# Altium schematic sheet Fan & Power Out.SchDoc: Laser PCB
size A3; DrawnBy: James Singleton; Organization: TMC Technology Ltd.; DocumentNumber: 4; Revision: A; SheetNumber: 2; SheetTotal: 18; Drawn Date: 22/12/2020
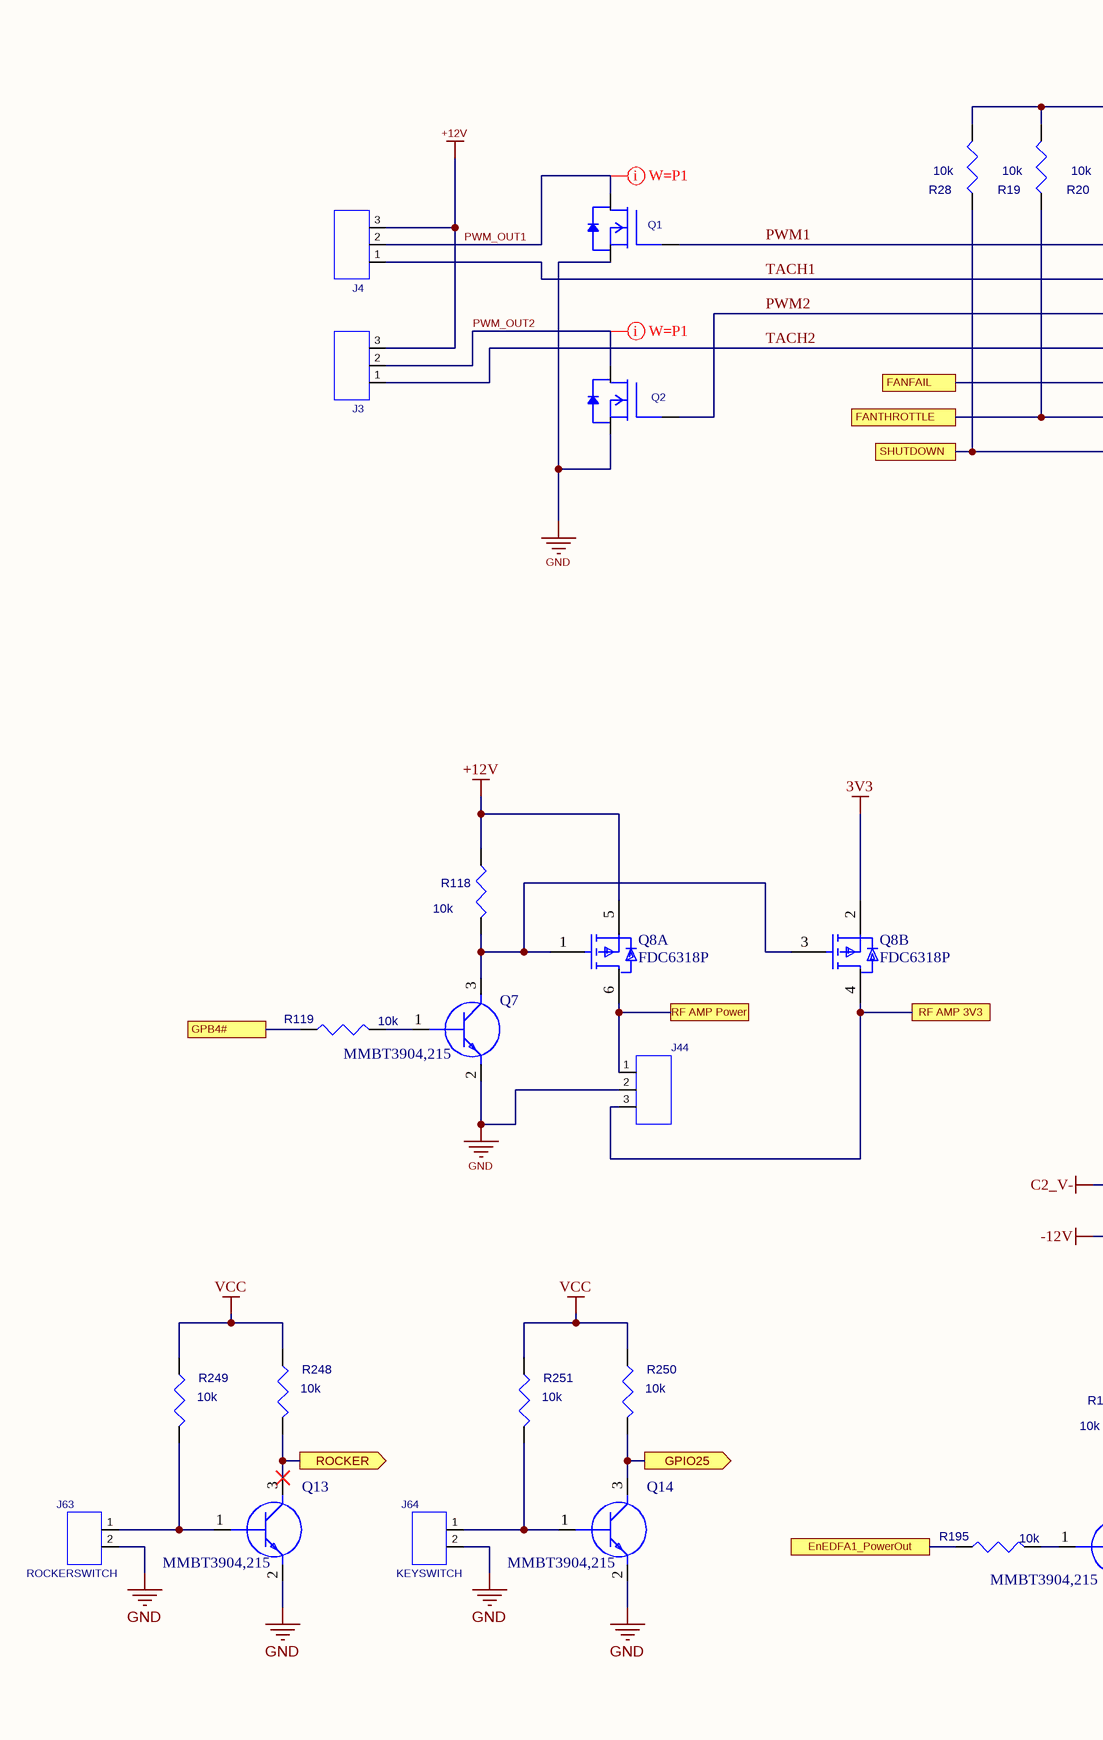
[diagram p0: Fan & Power Out.SchDoc, left]
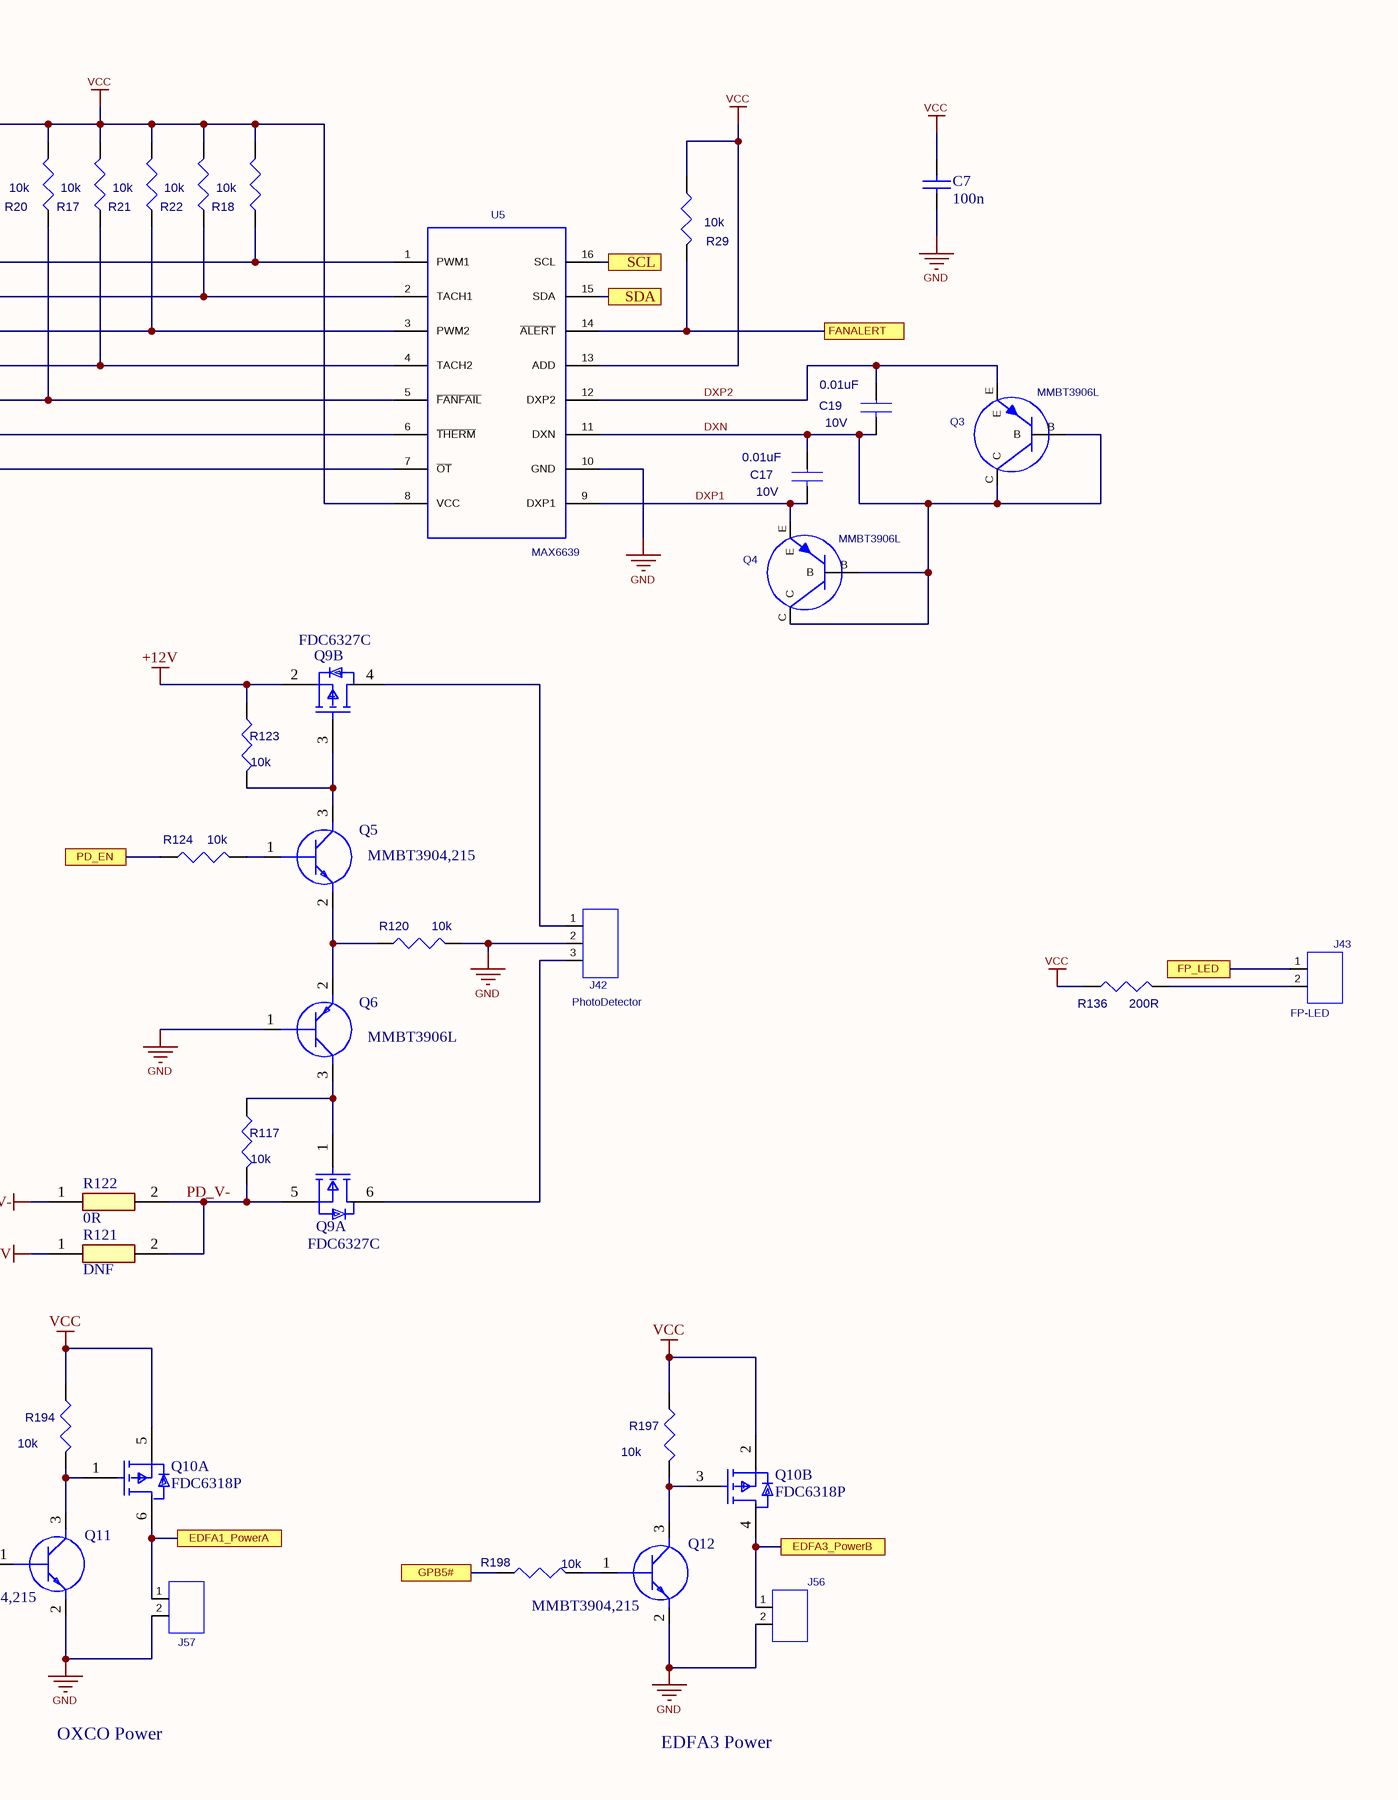
[diagram p1: Fan & Power Out.SchDoc, right]

## Parts
C7  100n  [CAPC1608X90X35LL15T15]
C17  value 0.01uF  Rated_Voltage: 10V  [CC0603N]  (hidden comment: CAP)
C19  value 0.01uF  Rated_Voltage: 10V  [CC0603N]  (hidden comment: CAP)
J3  CON03  [AE-6410-3W-VERTICAL]  (value not drawn)
J4  CON03  [AE-6410-3W-VERTICAL]  (value not drawn)
J42  PhotoDetector  [AE-6410-3W-VERTICAL]
J43  FP-LED  [AE-6410-2W-VERTICAL]
J44  CON03  [AE-6410-3W-VERTICAL]  (value not drawn)
J56  EDFA3 Power  [AE-6410-2W-VERTICAL]
J57  OXCO Power  [AE-6410-2W-VERTICAL]
J63  ROCKERSWITCH  [AE-6410-2W-VERTICAL]
J64  KEYSWITCH  [AE-6410-2W-VERTICAL]
Q1  DMG3418L-7  [SOT95P240X110-3N]  (value not drawn)
Q2  DMG3418L-7  [SOT95P240X110-3N]  (value not drawn)
Q3  MMBT3906L  [MMBT3906L]
Q4  MMBT3906L  [MMBT3906L]
Q5  MMBT3904,215  [MMBT3904215]
Q6  MMBT3906L  [SOT96P237X111-3N]
Q7  MMBT3904,215  [MMBT3904215]
Q8  FDC6318P  [ON_Semi_419BL_0]  (parts A,B of 2)
Q9  FDC6327C  [SOT95P275X110-6N]  (parts A,B of 2)
Q10  FDC6318P  [ON_Semi_419BL_0]  (parts A,B of 2)
Q11  MMBT3904,215  [MMBT3904215]
Q12  MMBT3904,215  [MMBT3904215]
Q13  MMBT3904,215  [MMBT3904215]
Q14  MMBT3904,215  [MMBT3904215]
R17  value 10k  [CR0603N]  (hidden comment: RES)
R18  value 10k  [CR0603N]  (hidden comment: RES)
R19  value 10k  [CR0603N]  (hidden comment: RES)
R20  value 10k  [CR0603N]  (hidden comment: RES)
R21  value 10k  [CR0603N]  (hidden comment: RES)
R22  value 10k  [CR0603N]  (hidden comment: RES)
R28  value 10k  [CR0603N]  (hidden comment: RES)
R29  value 10k  [CR0603N]  (hidden comment: RES)
R117  value 10k  [CR0603N]  (hidden comment: RES)
R118  value 10k  [CR0603N]  (hidden comment: RES)
R119  value 10k  [CR0603N]  (hidden comment: RES)
R120  value 10k  [CR0603N]  (hidden comment: RES)
R121  value DNF  [RESC1608X55N]
R122  value 0R  [RESC1608X55N]
R123  value 10k  [CR0603N]  (hidden comment: RES)
R124  value 10k  [CR0603N]  (hidden comment: RES)
R136  value 200R  [CR0603N]  (hidden comment: RES)
R194  value 10k  [CR0603N]  (hidden comment: RES)
R195  value 10k  [CR0603N]  (hidden comment: RES)
R197  value 10k  [CR0603N]  (hidden comment: RES)
R198  value 10k  [CR0603N]  (hidden comment: RES)
R248  value 10k  [CR0603N]  (hidden comment: RES)
R249  value 10k  [CR0603N]  (hidden comment: RES)
R250  value 10k  [CR0603N]  (hidden comment: RES)
R251  value 10k  [CR0603N]  (hidden comment: RES)
U5  MAX6639  [SOP63P602X173-16N]

## Ports
EDFA1_PowerA (see PIO[1A], PIO[2A]), EDFA3_PowerB (see PIO[1B], PIO[1C], PIO[2B], PIO[2C]), EnEDFA1_PowerOut (see PIO[2C]), FANALERT (see ChipSelects+Faults[1D]), FANFAIL (see ChipSelects+Faults[1D]), FANTHROTTLE (see ChipSelects+Faults[1D]), FP_LED (see PI_INTERFACE[3A]), GPB4# (see PIO[2C]), GPB5# (see PIO[2C]), GPIO25 (out, see PI_INTERFACE[5B]), PD_EN (see PIO[7B]), RF AMP 3V3, RF AMP Power, ROCKER (out, see PI_INTERFACE[3A]), SCL (see ADC-DAC[2C], ADC-DAC[3A], ADC-DAC[4B], ADC-DAC[4C], ADC-DAC[5C], ADC-DAC[6A], PI_INTERFACE[3A], TEC_CONTROLLER_1[6B], TEC_CONTROLLER_1[7A], TEC_CONTROLLER_1[8B]), SDA (see ADC-DAC[2C], ADC-DAC[3A], ADC-DAC[4B], ADC-DAC[4C], ADC-DAC[5C], ADC-DAC[6A], PI_INTERFACE[3A], TEC_CONTROLLER_1[6B], TEC_CONTROLLER_1[7A], TEC_CONTROLLER_1[7B]), SHUTDOWN (see ChipSelects+Faults[1D])

## Nets
3V3: Q8.2(S2)
+12V: J3.3 J4.3 Q8.5(S1) Q9.2(S2) R118.1 R123.1
-12V: R121.1
C2_V-: R122.1
GND: C7.2 J42.2 J44.2 J56.2 J57.2 J63.2 J64.2 Q1.2 Q2.2 Q6.1(B) Q7.2(E) Q11.2(E) Q12.2(E) Q13.2(E) Q14.2(E) R120.2 U5.10(GND)
VCC: C7.1 Q10.2(S2) Q10.5(S1) R17.2 R18.2 R19.2 R20.2 R21.2 R22.2 R28.2 R29.2 R136.1 R194.1 R197.1 R248.1 R249.1 R250.1 R251.1 U5.8(VCC) U5.13(ADD)
DXN: C17.1 C19.2 Q3.B Q3.C Q4.B Q4.C U5.11(DXN)
DXP1: C17.2 Q4.E U5.9(DXP1)
DXP2: C19.1 Q3.E U5.12(DXP2)
EDFA1_PowerA: J57.1 Q10.6(D1) ; port EDFA1_PowerA
EDFA3_PowerB: J56.1 Q10.4(D2) ; port EDFA3_PowerB
EnEDFA1_PowerOut: R195.1 ; port EnEDFA1_PowerOut
FANALERT: R29.1 U5.14(~{ALERT}) ; port FANALERT
FANFAIL: R20.1 U5.5(~{FANFAIL}) ; port FANFAIL
FANTHROTTLE: R19.1 U5.6(~{THERM}) ; port FANTHROTTLE
FP_LED: J43.1 ; port FP_LED
GPB4#: R119.1 ; port GPB4#
GPB5#: R198.1 ; port GPB5#
GPIO25: Q14.3(C) R250.2 ; port GPIO25
PD_EN: R124.1 ; port PD_EN
PD_V-: Q9.5(S2) R117.2 R121.2 R122.2
PWM1: Q1.1 R18.1 U5.1(PWM1)
PWM2: Q2.1 R21.1 U5.3(PWM2)
PWM_OUT1: J4.2 Q1.3
PWM_OUT2: J3.2 Q2.3
RF AMP 3V3: J44.3 Q8.4(D2) ; port RF AMP 3V3
RF AMP Power: J44.1 Q8.6(D1) ; port RF AMP Power
ROCKER: Q13.3(C) R248.2 ; port ROCKER
SCL: U5.16(SCL) ; port SCL
SDA: U5.15(SDA) ; port SDA
SHUTDOWN: R28.1 U5.7(~{OT}) ; port SHUTDOWN
TACH1: J4.1 R22.1 U5.2(TACH1)
TACH2: J3.1 R17.1 U5.4(TACH2)
NetJ42_1: J42.1 Q9.4(D2)
NetJ42_3: J42.3 Q9.6(D2)
NetJ43_2: J43.2 R136.2
NetJ63_1: J63.1 Q13.1(B) R249.2
NetJ64_1: J64.1 Q14.1(B) R251.2
NetQ5_1: Q5.1(B) R124.2
NetQ5_2: Q5.2(E) Q6.2(E) R120.1
NetQ5_3: Q5.3(C) Q9.3(G2) R123.2
NetQ6_3: Q6.3(C) Q9.1(G2) R117.1
NetQ7_1: Q7.1(B) R119.2
NetQ7_3: Q7.3(C) Q8.1(G1) Q8.3(G2) R118.2
NetQ10_1: Q10.1(G1) Q11.3(C) R194.2
NetQ10_3: Q10.3(G2) Q12.3(C) R197.2
NetQ11_1: Q11.1(B) R195.2
NetQ12_1: Q12.1(B) R198.2

## Layout directives
mark named W=P1: PWM_OUT1, PWM_OUT2

## Notes on the sheet
- TMC Technology Ltd.
- Page Contents:
- Project:
- Variant:
- Checked By:
- Size:
- Date:
- Dwg No:
- Sheet
- of
- Revision:

## Library data of the parts
C7 = CMP-1035-02592-3: Chip Capacitor, 100 nF, +/- 10%, 50 V, -55 to 125 degC, 0603 (1608 Metric), RoHS, Tape and Reel; Manufacturer: KEMET; Manufacturer Part Number: C0603C104K5RACTU; Case\Package: 0603; Type (Capacitors): X7R; Capacitance: 100 nF; Voltage Rating: 50 V; Pins: 2; Max Operating Temperature: 125 degC; Min Operating Temperature: -55 degC; Case Code (Imperial): 0603; DatasheetVersion: 07/2016; Package Quantity: 4000; Length: 1.6 mm; REACH SVHC: No SVHC; Packaging: Tape and Reel; Case Code (Metric): 1608; Mounting Technology: Surface Mount; RoHSCompliant: true; Height: 0.9 mm; ComponentLink1URL: http://www.avx.com/; ComponentLink2URL: http://datasheets.avx.com/X7RDielectric.pdf; Mount: Surface Mount; ComponentLink2Description: Datasheet; Width: 0.81 mm; PackageReference: 0603; PackageDescription: 2-Pin Surface Mount Device, Body 1.6 x 0.81 mm; Radiation Hardening: No; ComponentLink1Description: Manufacturer URL; Voltage Rating (DC): 50 V; Tolerance: 10%; 8Vinv: *
C17 C19 = CAP: CAP.,0.01uF,X5R,10V,10%,0603; Manufacturer: AVX; Manufacturer_PN: 0603ZD103KAT2A; FPLIST: CC0603N,CC0603L,CC0603M; CLASS: DISCRETE; Source_Path: \\MIL-NS1\CIP\SCHEMATIC_SYMBOLS\LTC_CAPACITOR.OLB; Geometry.Height: 37.40mil; Package_Size: 0603; Dielectric_Type: X5R; Tolerance: 10%; PCB DECAL: CC0603N
J3 J4 J42 = CON03: 3 pin Connector; MANUFACTURER1: ADIMPEX (Cod.  LE008003-R); Manufacturer: Molex; VALUE: STRIP1X3VM; SPEA DEVICE CODE: 700; PTEXT3: 3; PTEXT2: 2; PTEXT1: 1; Geometry.Height: 400 mil; UNNAMED1: DNF; Order No: 1360131; VAL: *; TOL: *; NTOL: *; MANUFACTURER2: Molex ( Cod. 22-03-2031 ); DEVICE TYPE: Connector; CASE TYPE: TH; PCB DECAL: AE-6410-3W-VERTICAL; Part No: 22-29-2031; System: Connector
J43 J63 J64 = CON02: 2 pin Connector, straight header, 2.54mm pitch; Part No: 2211S-02G; Manufacturer: Multicomp; Order No: 1593411; PCB DECAL: AE-6410-2W-VERTICAL
J44 = CON03: 3 pin Connector; Manufacturer: Molex; MANUFACTURER1: ADIMPEX (Cod.  LE008003-R); UNNAMED1: DNF; Order No: 1360131; VALUE: STRIP1X3VM; SPEA DEVICE CODE: 700; PTEXT3: 3; PTEXT2: 2; PTEXT1: 1; Geometry.Height: 400 mil; PCB DECAL: AE-6410-3W-VERTICAL; Part No: 22-29-2031; System: Connector; VAL: *; TOL: *; NTOL: *; MANUFACTURER2: Molex ( Cod. 22-03-2031 ); DEVICE TYPE: Connector; CASE TYPE: TH
J56 J57 = CON02: 2 pin Connector; Manufacturer: Molex; UNNAMED1: DNF; Order No: 1360130; PCB DECAL: AE-6410-2W-VERTICAL; Part No: 22-29-2021; System: Connector
Q1 Q2 = DMG3418L-7: MOSFET N-CH 30V 4A SOT23; Manufacturer: Diodes Inc; Geometry.Height: 1.1mm; Order No: 3276189; Part No: DMG3418L-7; PCB DECAL: SOT95P240X110-3N
Q3 Q4 = MMBT3906L: GENERAL PURPOSE PNP SILICON TRANSISTOR; Part Number: MMBT3906LT1G; Manufacturer #1: On Semiconductor; Manufacturer: On Semi; Order No: MMBT3906LT1GOSCT-ND; Geometry.Height: 1.1mm; PCB DECAL: MMBT3906L; Order Number: MMBT3906LT1G; Part No: MMBT3906L
Q5 Q7 Q11-Q14 = MMBT3904,215: Transistor BJT NPN; Manufacturer_Name: Nexperia; Datasheet Link: https://assets.nexperia.com/documents/data-sheet/MMBT3904.pdf; Height: 1.1mm; Manufacturer_Part_Number: MMBT3904,215; Mouser Part Number: 771-MMBT3904T/R; Mouser Price/Stock: https://www.mouser.co.uk/ProductDetail/Nexperia/MMBT3904215?qs=LOCUfHb8d9s%2FW6hzAJGDbw%3D%3D; Arrow Part Number: MMBT3904,215; Arrow Price/Stock: https://www.arrow.com/en/products/mmbt3904215/nexperia?region=nac
Q6 = MMBT3906LT1H: Transistor BJT PNP; Manufacturer_Name: onsemi; Datasheet Link: https://www.mouser.in/datasheet/2/308/1/on_semiconductor_mmbt3906lt1_d-1195239.pdf; Height: 1.11mm; Manufacturer_Part_Number: MMBT3906LT1H; Mouser Part Number: 863-MMBT3906LT1H; Mouser Price/Stock: https://www.mouser.co.uk/ProductDetail/onsemi/MMBT3906LT1H?qs=kbSN2QblFfK%252B3Tf0dtu%2FeQ%3D%3D; Arrow Part Number: MMBT3906LT1H; Arrow Price/Stock: https://www.arrow.com/en/products/mmbt3906lt1h/on-semiconductor?region=nac
Q9 = FDC6327C: Integrated Circuit; Manufacturer_Name: onsemi; Datasheet Link: https://datasheet.datasheetarchive.com/originals/distributors/Datasheets_SAMA/e301740928fca84ccc639c023f90bb32.pdf; Height: 1.1mm; Manufacturer_Part_Number: FDC6327C; Mouser Part Number: 512-FDC6327C; Mouser Price/Stock: https://www.mouser.co.uk/ProductDetail/ON-Semiconductor-Fairchild/FDC6327C?qs=iN0KuJO79KYSwrsClcAPjw%3D%3D; Arrow Part Number: FDC6327C; Arrow Price/Stock: https://www.arrow.com/en/products/fdc6327c/on-semiconductor?region=nac
R17-R22 R28 R29 R117-R120 R123 R124 R194 R195 R197 R198 R248-R251 = RES: RES.,10k OHMS,1%,1/10W,0603; Manufacturer_PN: ERJ3EKF1002V; Manufacturer: PANASONIC; Part No: P10.0KHCT-ND; CLASS: DISCRETE; Temperature_Coefficient: 100ppm/C; FPLIST: CR0603N,CR0603L,CR0603M; Source_Path: \\MIL-NS1\CIP\SCHEMATIC_SYMBOLS\LTC_RESISTOR.OLB; Geometry.Height: 37.40mil; PCB DECAL: CR0603N; Rated_Power: 1/10W; Tolerance: 1%; Package_Size: 0603
R121 R122 = RC0603FR-070RL: Resistor; Manufacturer_Name: YAGEO; Datasheet Link: https://componentsearchengine.com/Datasheets/2/RC0603FR-070RL.pdf; Height: 0.55mm; Manufacturer_Part_Number: RC0603FR-070RL; Mouser Part Number: 603-RC0603FR-070RL; Mouser Price/Stock: https://www.mouser.co.uk/ProductDetail/YAGEO/RC0603FR-070RL?qs=0yPvnVz5%2FmpDQv43TwvCfw%3D%3D; Arrow Part Number: RC0603FR-070RL; Arrow Price/Stock: https://www.arrow.com/en/products/rc0603fr-070rl/yageo?region=europe
R136 = RES: RES.,200 OHMS,1%,1/10W,0603; Manufacturer_PN: ERJ3EKF1002V; Manufacturer: PANASONIC; Part No: P10.0KHCT-ND; CLASS: DISCRETE; Temperature_Coefficient: 100ppm/C; FPLIST: CR0603N,CR0603L,CR0603M; Source_Path: \\MIL-NS1\CIP\SCHEMATIC_SYMBOLS\LTC_RESISTOR.OLB; Geometry.Height: 37.40mil; PCB DECAL: CR0603N; Rated_Power: 1/10W; Tolerance: 1%; Package_Size: 0603
U5 = MAX6639: Manufacturer: Maxim; Part No: MAX6639FAEE+; Geometry.Height: 1.73mm; Order No: 2515647; PCB DECAL: SOP63P602X173-16N